# EAGLE schematic VCO3340 v2 designblock (EAGLE 9.4.2)
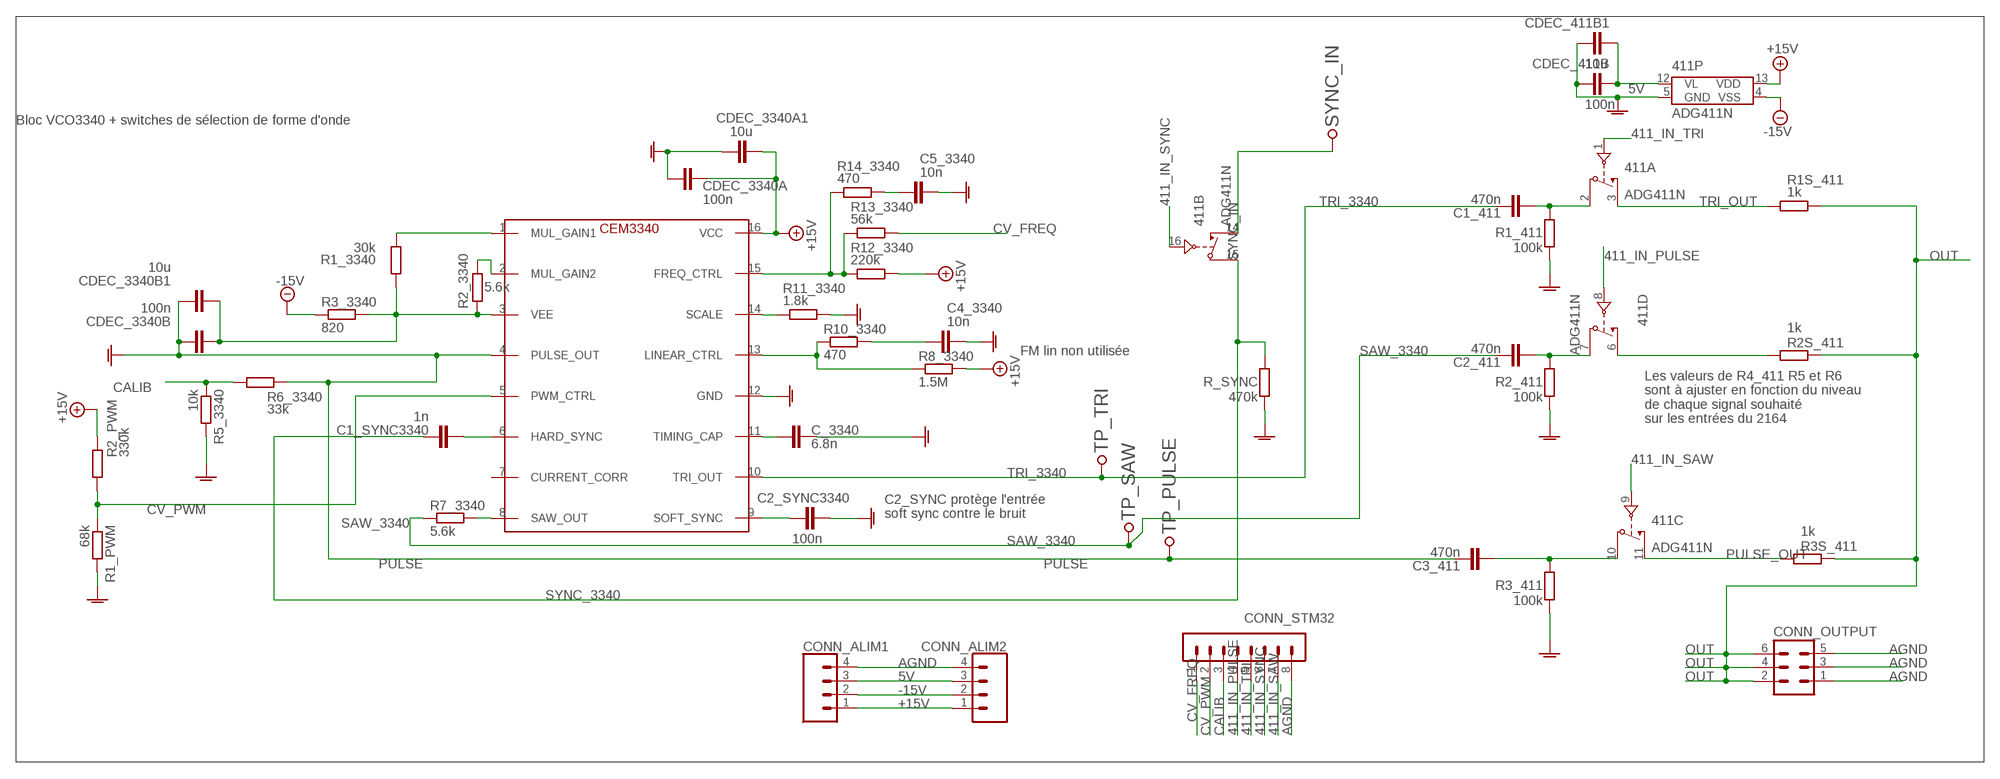
[diagram p0: schematic, sheet 1]

## Parts
411  ADG411N  [DIL16]
C1_411  470n  C-EU075-032X103  [C075-032X103]
C1_SYNC3340  1n  C-EU075-032X103  [C075-032X103]
C2_411  470n  C-EU075-032X103  [C075-032X103]
C2_SYNC3340  100n  C-EU075-032X103  [C075-032X103]
C3_411  470n  C-EU102-043X133  [C102-043X133]
C4_3340  10n  C-EU050-025X075  [C050-025X075]
C5_3340  10n  C-EU075-032X103  [C075-032X103]
C_3340  6.8n  C-EU050-025X075  [C050-025X075]
CDEC_411B  100n  C-EU050-025X075  [C050-025X075]
CDEC_411B1  10u  C-EU050-025X075  [C050-025X075]
CDEC_3340A  100n  C-EU050-025X075  [C050-025X075]
CDEC_3340A1  10u  C-EU050-025X075  [C050-025X075]
CDEC_3340B  100n  C-EU050-025X075  [C050-025X075]
CDEC_3340B1  10u  C-EU050-025X075  [C050-025X075]
CEM3340  CEM3340  [DIL16]
CONN_ALIM1  CONN_04  [1X04]
CONN_ALIM2  CONN_04  [1X04]
CONN_OUTPUT  MA03-2  [MA03-2]
CONN_STM32  MA08-1  [MA08-1]
R1_411  100k  R-EU_0207/10  [0207/10]
R1_3340  30k  R-EU_0204/7  [0204/7]
R1_PWM  68k  R-EU_0207/12  [0207/12]
R1S_411  1k  R-EU_0204/7  [0204/7]
R2_411  100k  R-EU_0207/10  [0207/10]
R2_3340  5.6k  R-EU_0204/7  [0204/7]
R2_PWM  330k  R-EU_0204/7  [0204/7]
R2S_411  1k  R-EU_0207/10  [0207/10]
R3_411  100k  R-EU_0204/7  [0204/7]
R3_3340  820  R-EU_0204/7  [0204/7]
R3S_411  1k  R-EU_0204/7  [0204/7]
R5_3340  10k  R-EU_0204/7  [0204/7]
R6_3340  33k  R-EU_0204/7  [0204/7]
R7_3340  5.6k  R-EU_0207/10  [0207/10]
R8_3340  1.5M  R-EU_0204/7  [0204/7]
R10_3340  470  R-EU_0204/7  [0204/7]
R11_3340  1.8k  R-EU_0204/7  [0204/7]
R12_3340  220k  R-EU_0204/7  [0204/7]
R13_3340  56k  R-EU_0204/7  [0204/7]
R14_3340  470  R-EU_0204/7  [0204/7]
R_SYNC  470k  R-EU_0204/7  [0204/7]
SYNC_IN  TESTPOINT  [TESTPOINT_63]
TP_PULSE  TESTPOINT  [TESTPOINT_63]
TP_SAW  TESTPOINT  [TESTPOINT_63]
TP_TRI  TESTPOINT  [TESTPOINT_63]

## Nets
5V: 411.12(P:VL) CDEC_411B1.1 CDEC_411B.1 CONN_ALIM1.3 CONN_ALIM2.3
411_IN_PULSE: 411.8(D:IN) CONN_STM32.4
411_IN_SAW: 411.9(C:IN) CONN_STM32.7
411_IN_SYNC: 411.16(B:IN) CONN_STM32.6
411_IN_TRI: 411.1(A:IN) CONN_STM32.5
+15V: 411.13(P:VDD) CDEC_3340A1.2 CDEC_3340A.2 CEM3340.16(VCC) CONN_ALIM1.1 CONN_ALIM2.1 R2_PWM.2 R8_3340.2 R12_3340.2
-15V: 411.4(P:VSS) CONN_ALIM1.2 CONN_ALIM2.2 R3_3340.1
AGND: 411.5(P:GND) C2_SYNC3340.1 C4_3340.2 C5_3340.1 C_3340.1 CDEC_411B1.2 CDEC_411B.2 CDEC_3340A1.1 CDEC_3340A.1 CEM3340.12(GND) CONN_ALIM1.4 CONN_ALIM2.4 CONN_OUTPUT.1 CONN_OUTPUT.3 CONN_OUTPUT.5 CONN_STM32.8 R1_411.1 R1_PWM.2 R2_411.1 R3_411.1 R5_3340.2 R11_3340.2 R_SYNC.1
CALIB: CONN_STM32.3 R5_3340.1 R6_3340.1
CV_FREQ: CONN_STM32.1 R13_3340.2
CV_PWM: CEM3340.5(PWM_CTRL) CONN_STM32.2 R1_PWM.1 R2_PWM.1
N$1: C2_SYNC3340.2 CEM3340.9(SOFT_SYNC)
N$2: 411.6(D:S) R2S_411.2
N$16: C1_SYNC3340.2 CEM3340.6(HARD_SYNC)
N$20: CEM3340.1(MUL_GAIN1) R1_3340.1
N$23: CEM3340.2(MUL_GAIN2) R2_3340.1
N$25: CEM3340.13(LINEAR_CTRL) R8_3340.1 R10_3340.1
N$28: CEM3340.8(SAW_OUT) R7_3340.2
N$30: CDEC_3340B1.2 CDEC_3340B.2 CEM3340.3(VEE) R1_3340.2 R2_3340.2 R3_3340.2
N$40: CEM3340.15(FREQ_CTRL) R12_3340.1 R13_3340.1 R14_3340.1
N$42: C5_3340.2 R14_3340.2
N$43: CEM3340.14(SCALE) R11_3340.1
N$45: C4_3340.1 R10_3340.2
N$46: C_3340.2 CEM3340.11(TIMING_CAP)
N$49: 411.2(A:D) C1_411.2 R1_411.2
N$50: 411.7(D:D) C2_411.2 R2_411.2
N$51: 411.10(C:D) C3_411.2 R3_411.2
OUT: CONN_OUTPUT.2 CONN_OUTPUT.4 CONN_OUTPUT.6 R1S_411.2 R2S_411.1 R3S_411.1
PULSE: C3_411.1 CDEC_3340B1.1 CDEC_3340B.1 CEM3340.4(PULSE_OUT) R6_3340.2 TP_PULSE.P$1 ; supply symbol labelled AGND
PULSE_OUT: 411.11(C:S) R3S_411.2
SAW_3340: C2_411.1 R7_3340.1 TP_SAW.P$1
SYNC_3340: 411.15(B:D) C1_SYNC3340.1 R_SYNC.2
SYNC_IN: 411.14(B:S) SYNC_IN.P$1
TRI_3340: C1_411.1 CEM3340.10(TRI_OUT) TP_TRI.P$1
TRI_OUT: 411.3(A:S) R1S_411.1
Unconnected: CEM3340.7(CURRENT_CORR)

## Notes on the sheet
- Bloc VCO3340 + switches de sélection de forme d'onde
- FM lin non utilisée
- Les valeurs de R4_411 R5 et R6 
  sont à ajuster en fonction du niveau 
  de chaque signal souhaité
  sur les entrées du 2164
- C2_SYNC protège l'entrée 
  soft sync contre le bruit

## Library data of the parts
411 = analog-devices:ADG411: LC2MOS Precision Quad SPST Switches Source: http://www.analog.com/static/imported-files/data_sheets/ADG411_412_413.pdf; MF: ALTERA CORPORATION; MPN: ADG411BN; OC_FARNELL: 1424317; OC_NEWARK: 05F6198
C1_411 C1_SYNC3340 C2_411 C2_SYNC3340 C3_411 C4_3340 C5_3340 C_3340 CDEC_411B CDEC_411B1 CDEC_3340A CDEC_3340A1 CDEC_3340B CDEC_3340B1 = rcl:C-EU: CAPACITOR, European symbol; SPICEPREFIX: C
CEM3340 = analog-audio-chips:CEM3340: Voltage Controlled Oscillator designed by Curtis.
CONN_ALIM1 CONN_ALIM2 = SparkFun-Connectors:CONN_04: Multi connection point. Often used as Generic Header-pin footprint for 0.1 inch spaced/style header connections On any of the 0.1 inch spaced packages, you can populate with these: Break Away Headers - Straight <https://www.sparkfun.com/products/116> (PRT-00116) Break Away Male Headers - Right Angle <https://www.sparkfun.com/products/553> (PRT-00553) Female Headers <https://www.sparkfun.com/products/115> (PRT-00115) Break Away Headers - Machine Pin <https://www.sparkfun.com/products/117> (PRT-00117) Break Away Female Headers - Swiss Machine Pin <https://www.sparkfun.com/products/743> (PRT-00743) For SCREWTERMINALS and SPRING TERMINALS visit here: Screw Terimnals on SparkFun.com <https://www.sparkfun.com/search/results?term=Screw+Terminals> (5mm/3.5mm/2.54mm spacing) This device is also useful as a general connection point to wire up your design to another part of your project. Our various solder wires solder well into these plated through hole pads. Hook-Up Wire - Assortment (Stranded, 22 AWG) <https://www.sparkfun.com/products/11375> (PRT-11375) Hook-Up Wire - Assortment (Solid Core, 22 AWG) <https://www.sparkfun.com/products/11367> (PRT-11367) View the entire wire category on our website here <https://www.sparkfun.com/categories/141> Special notes: Molex polarized connector foot print use with SKU : PRT-08231 with associated crimp pins and housings. 1MM SMD Version SKU: PRT-10208; PROD_ID: CONN-09696
CONN_OUTPUT = con-lstb:MA03-2: PIN HEADER; OC_FARNELL: unknown; OC_NEWARK: unknown
CONN_STM32 = con-lstb:MA08-1: PIN HEADER; OC_FARNELL: unknown; OC_NEWARK: unknown
R1_411 R1_3340 R1_PWM R1S_411 R2_411 R2_3340 R2_PWM R2S_411 R3_411 R3_3340 R3S_411 R5_3340 R6_3340 R7_3340 R8_3340 R10_3340 R11_3340 R12_3340 R13_3340 R14_3340 R_SYNC = rcl:R-EU_: RESISTOR, European symbol; SPICEPREFIX: R
SYNC_IN TP_PULSE TP_SAW TP_TRI = 6P1_EVB:TESTPOINT